# EAGLE design Adafruit proto pi plate (EAGLE 6.2)
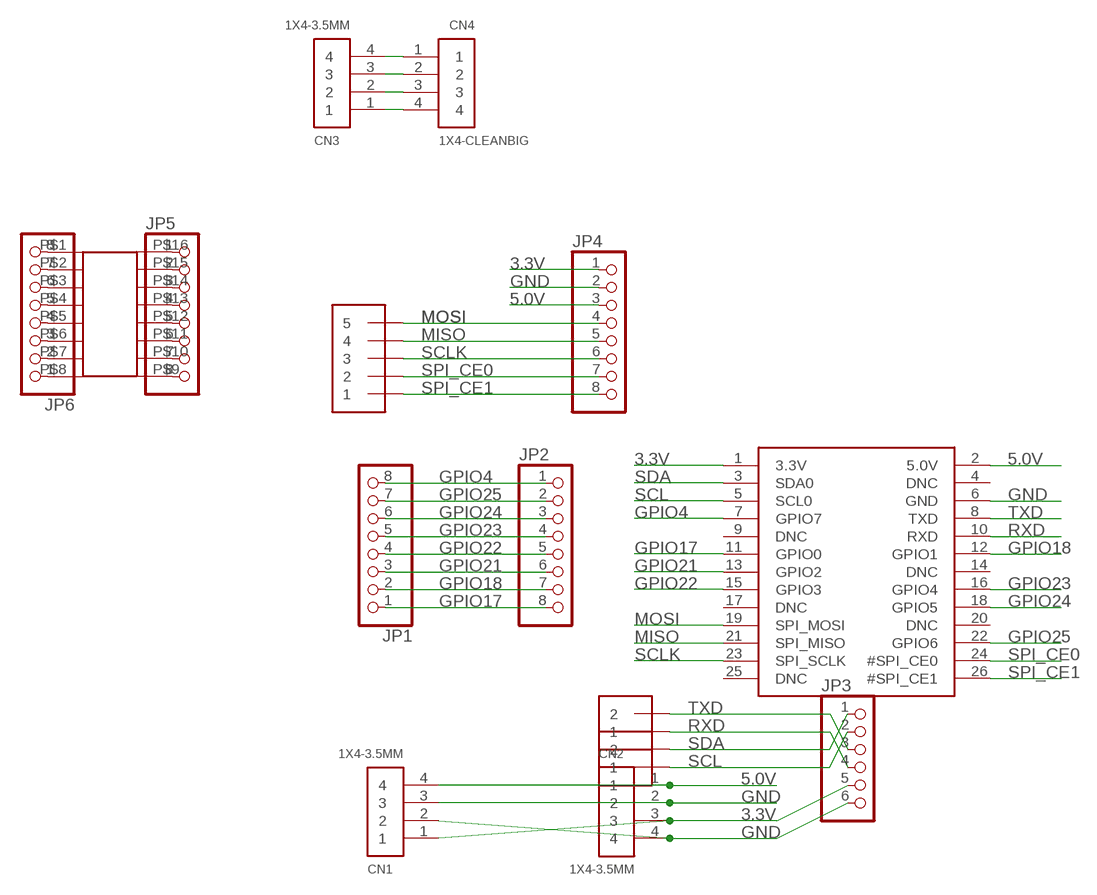
[diagram p0: schematic, sheet 1]

## Parts
CN1  1X4-3.5MM  [1X04-3.5MM]
CN2  1X4-3.5MM  [1X04-3.5MM]
CN3  1X4-3.5MM  [1X04-3.5MM]
CN4  1X4-CLEANBIG  [1X04-CLEANBIG]
J1  1X2-3.5MM  [1X2-3.5MM]
J2  1X2-3.5MM  [1X2-3.5MM]
J3  1X5  [1X05-3.5MM]
JP1  PINHD-1X8-3.5MM  [1X08-3.5MM]
JP2  PINHD-1X8BIG  [1X08-BIG]
JP3  PINHD-1X6B  [1X06-BIG]
JP4  PINHD-1X8BIG  [1X08-BIG]
JP5  PINHD-1X8BIG  [1X08-BIG]
JP6  PINHD-1X8BIG  [1X08-BIG]
U$1  RASPBERRYPI_BB  [RASBERRYPI_SHIELD]
U$2  SMD-16SOIC  [SO-16NMW]

## Nets
3.3V: CN1.1 CN2.3 JP3.5 JP4.1 U$1.1(3.3V)
5.0V: CN1.4 CN2.1 JP4.3 U$1.2(5.0V)
GND: CN1.2 CN1.3 CN2.2 CN2.4 JP3.6 JP4.2 U$1.6(GND)
GPIO4: JP1.8 JP2.1 U$1.7(GPIO7)
GPIO17: JP1.1 JP2.8 U$1.11(GPIO0)
GPIO18: JP1.2 JP2.7 U$1.12(GPIO1)
GPIO21: JP1.3 JP2.6 U$1.13(GPIO2)
GPIO22: JP1.4 JP2.5 U$1.15(GPIO3)
GPIO23: JP1.5 JP2.4 U$1.16(GPIO4)
GPIO24: JP1.6 JP2.3 U$1.18(GPIO5)
GPIO25: JP1.7 JP2.2 U$1.22(GPIO6)
MISO: J3.4 JP4.5 U$1.21(SPI_MISO)
MOSI: J3.5 JP4.4 U$1.19(SPI_MOSI)
N$33: JP5.1 U$2.P$16
N$62: JP5.2 U$2.P$15
N$63: JP5.3 U$2.P$14
N$64: JP5.4 U$2.P$13
N$65: JP5.5 U$2.P$12
N$66: JP5.6 U$2.P$11
N$67: JP5.7 U$2.P$10
N$68: JP5.8 U$2.P$9
N$69: JP6.1 U$2.P$8
N$70: JP6.2 U$2.P$7
N$71: JP6.3 U$2.P$6
N$72: JP6.4 U$2.P$5
N$73: JP6.5 U$2.P$4
N$74: JP6.6 U$2.P$3
N$75: JP6.7 U$2.P$2
N$82: JP6.8 U$2.P$1
N$104: CN3.4 CN4.1
N$105: CN3.3 CN4.2
N$106: CN3.2 CN4.3
N$107: CN3.1 CN4.4
RXD: J2.1 JP3.4 U$1.10(RXD)
SCL: J1.1 JP3.2 U$1.5(SCL0)
SCLK: J3.3 JP4.6 U$1.23(SPI_SCLK)
SDA: J1.2 JP3.1 U$1.3(SDA0)
SPI_CE0: J3.2 JP4.7 U$1.24(#SPI_CE0)
SPI_CE1: J3.1 JP4.8 U$1.26(#SPI_CE1)
TXD: J2.2 JP3.3 U$1.8(TXD)
Unconnected: U$1.4(DNC) U$1.9(DNC) U$1.14(DNC) U$1.17(DNC) U$1.20(DNC) U$1.25(DNC)

## Library data of the parts
CN1-CN4 = adafruit:1X4: 4-pin connector
J1 J2 = adafruit:1X2: 3.5mm Terminal block http://www.ladyada.net/library/pcb/eaglelibrary.html
J3 = adafruit:1X5
JP1 JP2 JP4-JP6 = adafruit:PINHD-1X8: PIN HEADER
JP3 = adafruit:PINHD-1X6: PIN HEADER
U$1 = microbuilder:RASPBERRYPI_B
U$2 = boogie:SMD-16

## Board
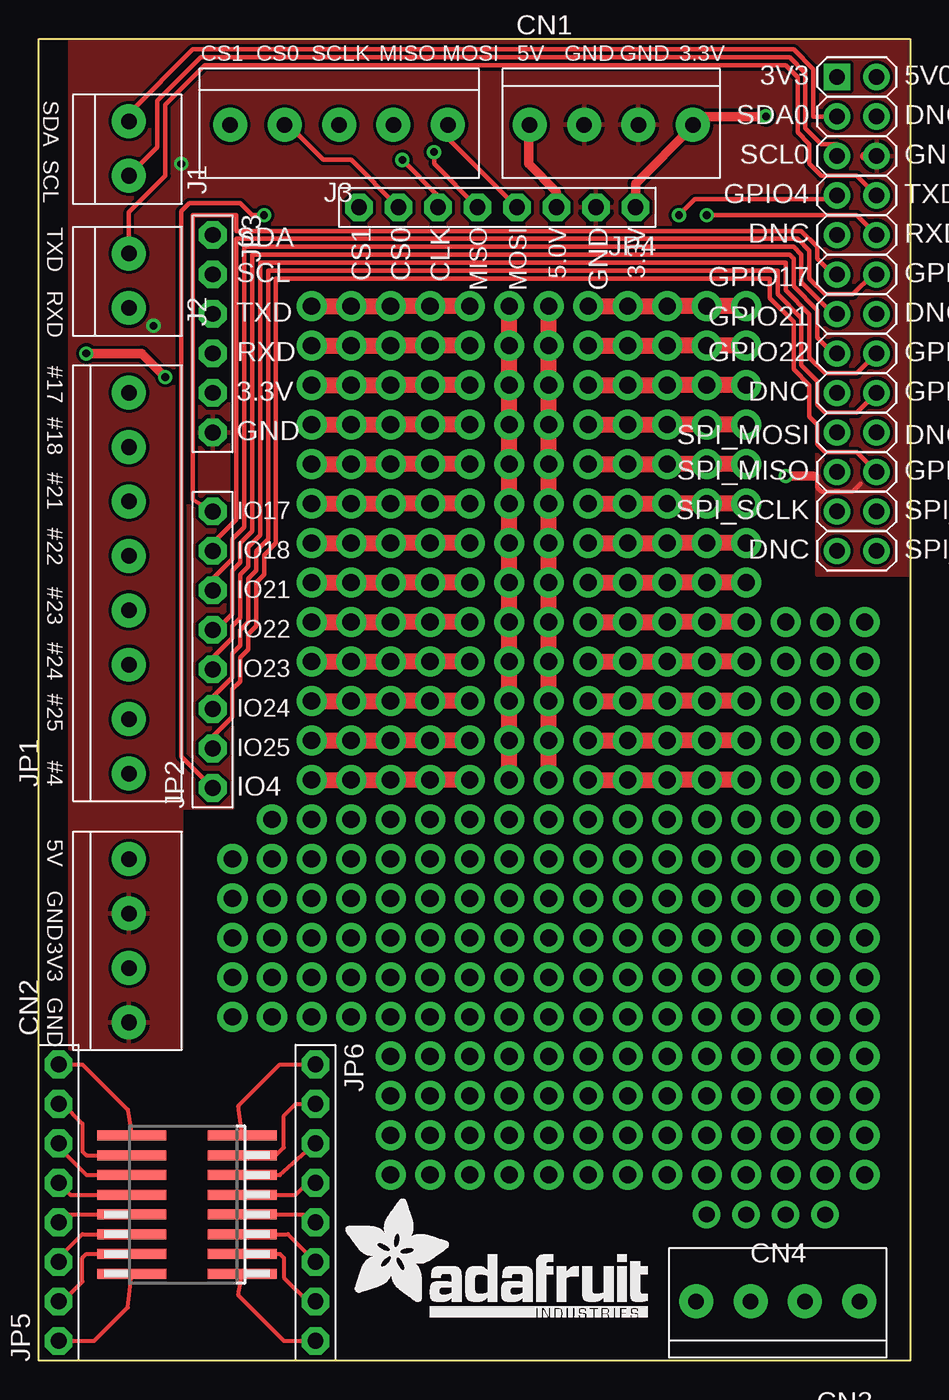
[diagram p1: board, top side]
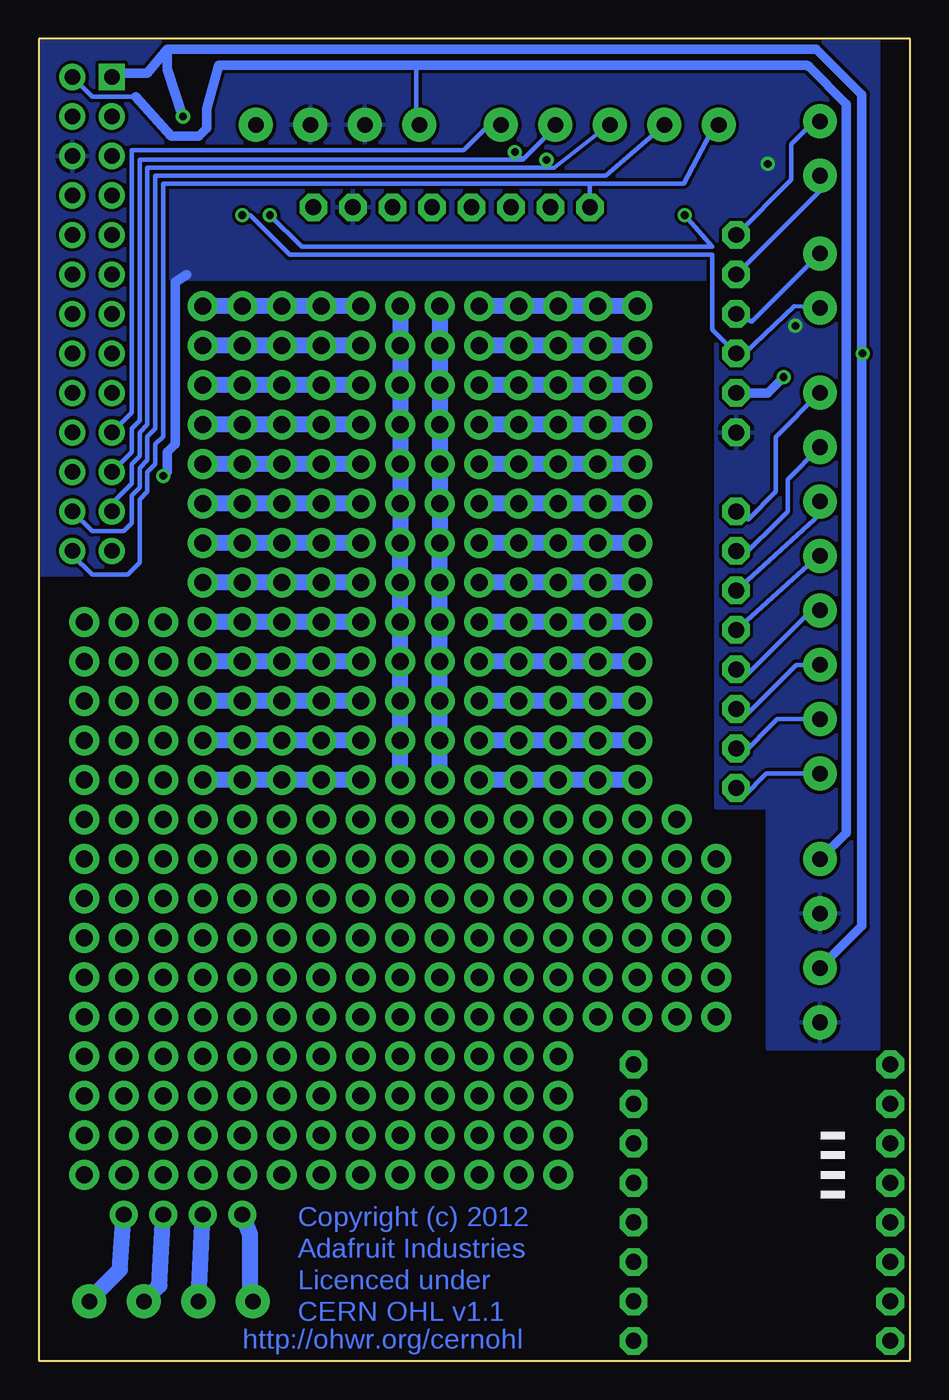
[diagram p2: board, bottom side, seen from below]

Size 56 x 85 mm. Coordinates in mm from the lower left corner, seen from the top.
Outline: 56,0 0,0 0,85 56,85
Copper layers (1*16): Top 0.035mm / dielectric 1.5mm / Bottom 0.035mm
Design rules: minimum track width 8mil, minimum drill 15mil, track to track 8mil, track to pad 8mil, pad to pad 8mil, via to via 8mil, smd to smd 8mil, copper to edge 1mil, drill to drill 8mil, minimum pad ring 10mil, minimum via ring 8mil, stop-mask expansion 4mil, vias tented up to drill 20mil, thermal gap 10mil

### Footprints (pad centres in the part's own frame; a part is rotated, then mirrored left to right if it is on the bottom)
1X04-3.5MM = drill 1 pad 2.184: 1 -5.25,0; 2 -1.75,0; 3 1.75,0; 4 5.25,0
1X04-CLEANBIG = drill 1.016 pad 1.778: 1 -3.81,0; 2 -1.27,0; 3 1.27,0; 4 3.81,0
1X2-3.5MM = drill 1 pad 2.184: 1 1.8,0; 2 -1.7,0
1X05-3.5MM = drill 1 pad 2.184: 1 7,0; 2 3.5,0; 3 0,0; 4 -3.5,0; 5 -7,0
1X08-3.5MM = drill 1 pad 2.184: 1 -12.25,0; 2 -8.75,0; 3 -5.25,0; 4 -1.75,0; 5 1.75,0; 6 5.25,0; 7 8.75,0; 8 12.25,0
1X08-BIG = drill 1.016 pad 1.778 octagon: 1 -8.89,0; 2 -6.35,0; 3 -3.81,0; 4 -1.27,0; 5 1.27,0; 6 3.81,0; 7 6.35,0; 8 8.89,0
1X06-BIG = drill 1.016 pad 1.778 octagon: 1 -6.35,0; 2 -3.81,0; 3 -1.27,0; 4 1.27,0; 5 3.81,0; 6 6.35,0
RASBERRYPI_SHIELD = drill 1 pad 1.676 square: 1 51.308,82.55 | drill 1 pad 1.676: 2 53.848,82.55; 3 51.308,80.01; 4 53.848,80.01; 5 51.308,77.47; 6 53.848,77.47; 7 51.308,74.93; 8 53.848,74.93; 9 51.308,72.39; 10 53.848,72.39; 11 51.308,69.85; 12 53.848,69.85; 13 51.308,67.31; 14 53.848,67.31; 15 51.308,64.77; 16 53.848,64.77; 17 51.308,62.23; 18 53.848,62.23; 19 51.308,59.69; 20 53.848,59.69; 21 51.308,57.15; 22 53.848,57.15; 23 51.308,54.61; 24 53.848,54.61; 25 51.308,52.07; 26 53.848,52.07
SO-16NMW = smd 0.635 x 4.445: P$1 -3.048,-3.683; P$2 -1.778,-3.683; P$3 -0.508,-3.683; P$4 0.762,-3.683; P$5 2.032,-3.683; P$6 3.302,-3.683; P$7 4.572,-3.683; P$8 5.842,-3.683; P$9 5.842,3.429; P$10 4.572,3.429; P$11 3.302,3.429; P$12 2.032,3.429; P$13 0.762,3.429; P$14 -0.508,3.429; P$15 -1.778,3.429; P$16 -3.048,3.429

### Placement (x,y rotation side)
CN1  36.79,79.47 180 top
CN2  5.79,27 270 top
CN3  47.5,3.81 0 top
CN4  46.74,9.4 180 top
J1  5.79,78 270 top
J2  5.79,69.5 270 top
J3  19.29,79.47 180 top
JP1  5.79,50 270 top
JP2  11.18,45.72 90 top
JP3  11.18,66.04 270 top
JP4  29.46,74.17 180 top
JP5  1.27,10.16 90 top
JP6  17.78,10.16 270 top
U$1  0,0 0 top
U$2  9.4,8.64 90 top
U$3  [ADAFRUIT_TEXT_20MM]  19.56,2.79 0 top

### Tracks (layer width: path | path; a pad name or v marks a point on that pad's centre or on a via)
3.3V  (via drill 0.5)
  Top 0.61: JP4.1 38.35,75.69 42.04,79.38 CN1.1 42.59,80.01 v46.74,80.01 | v3.05,64.77 6.6,64.77 v8.13,63.25
  Bottom 0.61: CN2.3 3.09,27.95 3.09,64.77 | 3.09,64.77 3.09,81.4 6.01,84.33 47.75,84.33 | U$1.1 51.05,82.8 49.02,82.8 47.75,84.33 | v46.74,80.01 47.75,83.06 47.75,84.33 | 3.09,64.77 v3.05,64.77 | JP3.5 9.14,62.23 v8.13,63.25
5.0V
  Top 0.61: JP4.3 33.27,75.18 31.5,76.96 31.5,79.42 CN1.4
  Bottom 0.305: CN1.4 31.58,79.5 31.75,79.5 31.75,83.31 | U$1.2 52.58,81.28 49.78,81.28
  Bottom 0.61: CN2.1 4.09,33.95 4.09,80.8 6.49,83.2 6.63,83.31 31.75,83.31 44.45,83.31 45.21,80.52 45.21,79.25 45.72,78.74 47.5,78.74 49.78,81.28 | CN1.4 31.49,79.47
GND  (via drill 0.5)
  Top 0.305: 52.83,56.39 52.32,55.88 50.29,55.88 50.04,56.13 50.04,56.9 49.78,56.9
  Top 0.61: U$1.6 53.09,77.47 | v48.01,56.9 49.78,56.9
  Bottom 0.61: v48.01,56.9 47.75,57.15 47.75,58.42 47.24,58.93 47.24,69.34 46.48,69.85
  other vias: 7.37,66.55 9.14,76.96
  pour Bottom: 2.03,20.07 2.03,85.09 55.88,85.09 56.13,50.55 50.04,50.55 50.04,69.6 12.45,69.6 12.45,35.56 9.14,35.56 9.14,20.07
  pour Top: 2.03,20.07 2.03,85.09 55.88,85.09 56.13,50.55 50.04,50.55 50.04,69.6 12.45,69.6 12.45,35.56 9.14,35.56 9.14,20.07
GPIO4  (via drill 0.5)
  Top 0.305: JP2.1 9.14,38.86 9.14,73.91 9.65,74.42 12.95,74.42 13.72,73.66 v14.48,73.66 | v41.15,73.66 42.16,74.68 51.05,74.68 U$1.7
  Bottom 0.305: JP2.1 10.67,36.32 9.24,37.75 JP1.8 | v14.48,73.66 12.7,71.63 39.12,71.63 v41.15,73.66
GPIO17
  Top 0.305: JP2.8 9.91,55.37 9.91,73.66 12.7,73.66 12.7,72.64 49.02,72.64 50.04,71.63 50.04,70.87 51.05,69.85 U$1.11
  Bottom 0.305: JP1.1 8.64,59.4 8.64,55.88 10.41,54.1 JP2.8
GPIO18
  Top 0.305: U$1.12 53.59,69.85 52.32,68.58 50.55,68.58 49.53,69.6 49.53,71.37 48.77,72.14 12.7,72.14 12.7,54.1 11.18,52.58 JP2.7
  Bottom 0.305: JP1.2 7.87,56.66 7.87,54.61 11.18,51.31 JP2.7
GPIO21
  Top 0.305: U$1.13 51.05,67.31 49.02,69.34 49.02,71.12 48.51,71.63 13.21,71.63 13.21,53.59 12.45,52.83 12.45,51.56 11.18,50.29 JP2.6
  Bottom 0.305: JP1.3 5.79,54.41 JP2.6
GPIO22
  Top 0.305: U$1.15 51.05,64.77 50.04,65.79 50.04,67.56 48.51,69.09 48.51,70.87 48.26,71.12 13.72,71.12 13.72,53.34 12.95,52.58 12.95,51.31 12.45,50.8 12.45,48.01 11.43,46.99 JP2.5
  Bottom 0.305: JP1.4 5.91,51.75 JP2.5
GPIO23
  Top 0.305: U$1.16 52.58,63.5 50.55,63.5 49.53,64.52 49.53,67.31 48.01,68.83 48.01,70.61 14.22,70.61 14.22,53.09 13.46,52.32 13.46,51.05 12.95,50.55 12.95,47.75 12.45,47.24 12.45,46.48 11.18,45.21 JP2.4
  Bottom 0.305: JP2.4 10.67,43.94 6.36,48.25 JP1.5
GPIO24
  Top 0.305: 11.43,41.4 JP2.3 11.18,42.67 12.45,43.94 12.45,45.47 12.95,45.97 12.95,46.99 13.46,47.5 13.46,50.29 13.97,50.8 13.97,52.07 14.73,52.83 14.73,70.1 47.5,70.1 47.5,68.58 49.02,67.06 49.02,64.01 50.04,62.99 50.04,61.47 50.55,60.96 52.58,60.96 U$1.18
  Bottom 0.305: JP2.3 10.67,41.4 7.32,44.75 JP1.6
GPIO25
  Top 0.305: U$1.22 52.58,58.42 50.55,58.42 50.04,58.93 50.04,60.2 49.53,60.71 49.53,62.74 48.51,63.75 48.51,66.8 46.99,68.33 46.99,69.6 15.24,69.6 15.24,52.58 14.48,51.82 14.48,50.55 13.97,50.04 13.97,47.24 13.46,46.74 13.46,45.72 12.95,45.21 12.95,43.69 12.45,43.18 12.45,41.4 11.18,40.13 JP2.2
  Bottom 0.305: JP2.2 10.92,38.86 8.53,41.25 JP1.7
MISO  (via drill 0.5)
  Top 0.305: JP4.5 25.4,76.96 v25.4,77.72
  Bottom 0.305: U$1.21 50.04,58.42 50.04,59.94 49.53,60.45 49.53,77.22 24.89,77.22 | J3.4 22.79,79.31 24.89,77.22 | 24.89,77.22 v25.4,77.72
MOSI
  Top 0.305: J3.5 26.33,79.5 26.42,79.5 26.42,78.49 JP4.4
  Bottom 0.305: 51.24,59.76 51.24,59.8 51.31,59.87 | 51.31,59.87 51.31,59.94 | 51.31,59.87 U$1.19 50.04,60.96 50.04,77.83 28.7,77.83 27.03,79.5 26.42,79.5 | 26.42,79.5 26.38,79.47 J3.5 26.33,79.5 26.42,79.5
N$1  (via drill 1.1 pad 1.93)
  other vias: 17.53,34.8
N$2  (via drill 1.1 pad 1.93)
  other vias: 20.07,34.8
N$3  (via drill 1.1 pad 1.93)
  other vias: 22.61,34.8
N$4  (via drill 1.1 pad 1.93)
  other vias: 25.15,34.8
N$5  (via drill 1.1 pad 1.93)
  other vias: 27.69,34.8
N$6  (via drill 1.1 pad 1.93)
  Top 1.016: v30.23,37.34 v30.23,67.82
  Bottom 1.016: v30.23,67.82 v30.23,65.28 v30.23,62.74 v30.23,60.2 v30.23,57.66 v30.23,55.12 v30.23,52.58 v30.23,50.04 v30.23,47.5 v30.23,44.96 v30.23,42.42 v30.23,39.88 v30.23,37.34
N$7  (via drill 1.1 pad 1.93)
  other vias: 30.23,34.8
N$8  (via drill 1.1 pad 1.93)
  Top 1.016: v32.77,37.34 v32.77,67.82
  Bottom 1.016: v32.77,67.82 v32.77,65.28 v32.77,62.74 v32.77,60.2 v32.77,57.66 v32.77,55.12 v32.77,52.58 v32.77,50.04 v32.77,47.5 v32.77,44.96 v32.77,42.42 v32.77,39.88 v32.77,37.34
N$9  (via drill 1.1 pad 1.93)
  other vias: 32.77,34.8
N$10  (via drill 1.1 pad 1.93)
  other vias: 35.31,34.8
N$11  (via drill 1.1 pad 1.93)
  other vias: 37.85,34.8
N$12  (via drill 1.1 pad 1.93)
  other vias: 40.39,34.8
N$13  (via drill 1.1 pad 1.93)
  other vias: 17.53,32.26
N$14  (via drill 1.1 pad 1.93)
  other vias: 17.53,29.72
N$15  (via drill 1.1 pad 1.93)
  other vias: 17.53,27.18
N$16  (via drill 1.1 pad 1.93)
  other vias: 17.53,24.64
N$17  (via drill 1.1 pad 1.93)
  other vias: 20.07,24.64
N$18  (via drill 1.1 pad 1.93)
  other vias: 20.07,27.18
N$19  (via drill 1.1 pad 1.93)
  other vias: 20.07,29.72
N$20  (via drill 1.1 pad 1.93)
  other vias: 20.07,32.26
N$21  (via drill 1.1 pad 1.93)
  other vias: 22.61,32.26
N$22  (via drill 1.1 pad 1.93)
  other vias: 22.61,29.72
N$23  (via drill 1.1 pad 1.93)
  other vias: 22.61,27.18
N$24  (via drill 1.1 pad 1.93)
  other vias: 22.61,24.64
N$25  (via drill 1.1 pad 1.93)
  other vias: 25.15,24.64
N$26  (via drill 1.1 pad 1.93)
  other vias: 25.15,27.18
N$27  (via drill 1.1 pad 1.93)
  other vias: 25.15,29.72
N$28  (via drill 1.1 pad 1.93)
  other vias: 25.15,32.26
N$29  (via drill 1.1 pad 1.93)
  other vias: 27.69,32.26
N$30  (via drill 1.1 pad 1.93)
  other vias: 27.69,29.72
N$31  (via drill 1.1 pad 1.93)
  other vias: 27.69,27.18
N$32  (via drill 1.1 pad 1.93)
  other vias: 27.69,24.64
N$33
  Top 0.254: U$2.P$16 5.71,3.43 3.56,1.27 JP5.1
N$34  (via drill 1.1 pad 1.93)
  other vias: 42.93,34.8
N$35  (via drill 1.1 pad 1.93)
  other vias: 42.93,29.72
N$36  (via drill 1.1 pad 1.93)
  other vias: 42.93,32.26
N$37  (via drill 1.1 pad 1.93)
  other vias: 42.93,27.18
N$38  (via drill 1.1 pad 1.93)
  other vias: 42.93,24.64
N$39  (via drill 1.1 pad 1.93)
  other vias: 42.93,22.1
N$40  (via drill 1.1 pad 1.93)
  other vias: 42.93,19.56
N$41  (via drill 1.1 pad 1.93)
  other vias: 30.23,24.64
N$42  (via drill 1.1 pad 1.93)
  other vias: 32.77,24.64
N$43  (via drill 1.1 pad 1.93)
  other vias: 35.31,24.64
N$44  (via drill 1.1 pad 1.93)
  other vias: 37.85,24.64
N$45  (via drill 1.1 pad 1.93)
  other vias: 40.39,24.64
N$46  (via drill 1.1 pad 1.93)
  other vias: 40.39,27.18
N$47  (via drill 1.1 pad 1.93)
  other vias: 40.39,29.72
N$48  (via drill 1.1 pad 1.93)
  other vias: 40.39,32.26
N$49  (via drill 1.1 pad 1.93)
  other vias: 37.85,32.26
N$50  (via drill 1.1 pad 1.93)
  other vias: 35.31,32.26
N$51  (via drill 1.1 pad 1.93)
  other vias: 30.23,32.26
N$52  (via drill 1.1 pad 1.93)
  other vias: 30.23,29.72
N$53  (via drill 1.1 pad 1.93)
  other vias: 30.23,27.18
N$54  (via drill 1.1 pad 1.93)
  other vias: 32.77,27.18
N$55  (via drill 1.1 pad 1.93)
  other vias: 32.77,29.72
N$56  (via drill 1.1 pad 1.93)
  other vias: 32.77,32.26
N$57  (via drill 1.1 pad 1.93)
  other vias: 35.31,29.72
N$58  (via drill 1.1 pad 1.93)
  other vias: 35.31,27.18
N$59  (via drill 1.1 pad 1.93)
  other vias: 37.85,27.18
N$60  (via drill 1.1 pad 1.93)
  other vias: 37.85,29.72
N$61  (via drill 1.1 pad 1.93)
  other vias: 17.53,22.1
N$62
  Top 0.254: U$2.P$15 3.05,6.86 2.79,6.6 2.79,5.08 1.52,3.81 JP5.2
N$63
  Top 0.254: JP5.3 1.27,6.6 2.79,8.13 U$2.P$14
N$64
  Top 0.254: U$2.P$13 1.78,9.4 JP5.4
N$65
  Top 0.254: U$2.P$12 2.03,10.67 JP5.5
N$66
  Top 0.254: JP5.6 1.27,13.72 3.05,11.94 U$2.P$11
N$67
  Top 0.254: U$2.P$10 3.05,13.21 2.79,13.46 2.79,15.24 1.52,16.51 JP5.7
N$68
  Top 0.254: U$2.P$9 5.71,16.13 2.79,19.05 JP5.8
N$69
  Top 0.254: U$2.P$8 12.83,16.38 15.49,19.05 JP6.1
N$70
  Top 0.254: U$2.P$7 15.24,13.21 15.75,13.72 15.75,15.75 16.51,16.51 JP6.2
N$71
  Top 0.254: U$2.P$6 15.49,11.94 JP6.3
N$72
  Top 0.254: JP6.4 17.27,11.43 16.51,10.67 U$2.P$5
N$73
  Top 0.254: U$2.P$4 17.02,9.4 JP6.5
N$74
  Top 0.254: U$2.P$3 16,8.13 JP6.6
N$75
  Top 0.254: U$2.P$2 15.49,6.86 15.75,6.6 15.75,5.33 17.27,3.81 JP6.7
N$76  (via drill 1.1 pad 1.93)
  other vias: 20.07,22.1
N$77  (via drill 1.1 pad 1.93)
  other vias: 22.61,22.1
N$78  (via drill 1.1 pad 1.93)
  other vias: 22.61,19.56
N$79  (via drill 1.1 pad 1.93)
  other vias: 22.61,14.48
N$80  (via drill 1.1 pad 1.93)
  other vias: 22.61,17.02
N$81  (via drill 1.1 pad 1.93)
  other vias: 22.61,11.94
N$82
  Top 0.254: U$2.P$1 12.83,4.19 15.75,1.27 JP6.8
N$83  (via drill 1.1 pad 1.93)
  other vias: 12.45,32.26
N$84  (via drill 1.1 pad 1.93)
  other vias: 12.45,29.72
N$85  (via drill 1.1 pad 1.93)
  other vias: 12.45,27.18
N$86  (via drill 1.1 pad 1.93)
  other vias: 12.45,24.64
N$87  (via drill 1.1 pad 1.93)
  other vias: 25.15,11.94
N$88  (via drill 1.1 pad 1.93)
  other vias: 25.15,17.02
N$89  (via drill 1.1 pad 1.93)
  other vias: 25.15,19.56
N$90  (via drill 1.1 pad 1.93)
  other vias: 25.15,22.1
N$91  (via drill 1.1 pad 1.93)
  other vias: 27.69,22.1
N$92  (via drill 1.1 pad 1.93)
  other vias: 27.69,17.02
N$93  (via drill 1.1 pad 1.93)
  other vias: 27.69,19.56
N$94  (via drill 1.1 pad 1.93)
  other vias: 27.69,11.94
N$95  (via drill 1.1 pad 1.93)
  other vias: 25.15,14.48
N$96  (via drill 1.1 pad 1.93)
  other vias: 27.69,14.48
N$97  (via drill 1.1 pad 1.93)
  other vias: 12.45,22.1
N$98  (via drill 1.1 pad 1.93)
  other vias: 14.99,34.8
N$101  (via drill 1.1 pad 1.93)
  other vias: 42.93,17.02
N$102  (via drill 1.1 pad 1.93)
  other vias: 42.93,14.48
N$103  (via drill 1.1 pad 1.93)
  other vias: 42.93,11.94
N$104
  Bottom 1.016: CN3.4 53,3.64 50.8,5.84 CN4.1
N$105
  Bottom 1.016: CN3.3 49.5,3.58 48.26,4.83 CN4.2
N$106
  Bottom 1.016: CN3.2 46,3.78 45.72,4.06 CN4.3
N$107
  Bottom 1.016: CN3.1 42.42,3.56 42.42,8.13 CN4.4
N$110  (via drill 1.1 pad 1.93)
  other vias: 45.47,11.94
N$111  (via drill 1.1 pad 1.93)
  other vias: 45.47,14.48
N$112  (via drill 1.1 pad 1.93)
  other vias: 45.47,19.56
N$113  (via drill 1.1 pad 1.93)
  other vias: 45.47,17.02
N$114  (via drill 1.1 pad 1.93)
  other vias: 45.47,22.1
N$115  (via drill 1.1 pad 1.93)
  other vias: 45.47,24.64
N$116  (via drill 1.1 pad 1.93)
  other vias: 45.47,27.18
N$119  (via drill 1.1 pad 1.93)
  other vias: 30.23,11.94
N$120  (via drill 1.1 pad 1.93)
  other vias: 30.23,14.48
N$121  (via drill 1.1 pad 1.93)
  other vias: 30.23,19.56
N$122  (via drill 1.1 pad 1.93)
  other vias: 30.23,22.1
N$123  (via drill 1.1 pad 1.93)
  other vias: 32.77,22.1
N$124  (via drill 1.1 pad 1.93)
  other vias: 35.31,22.1
N$125  (via drill 1.1 pad 1.93)
  other vias: 37.85,22.1
N$126  (via drill 1.1 pad 1.93)
  other vias: 40.39,22.1
N$127  (via drill 1.1 pad 1.93)
  other vias: 40.39,19.56
N$128  (via drill 1.1 pad 1.93)
  other vias: 37.85,19.56
N$129  (via drill 1.1 pad 1.93)
  other vias: 35.31,19.56
N$130  (via drill 1.1 pad 1.93)
  other vias: 32.77,19.56
N$131  (via drill 1.1 pad 1.93)
  other vias: 32.77,17.02
N$132  (via drill 1.1 pad 1.93)
  other vias: 30.23,17.02
N$133  (via drill 1.1 pad 1.93)
  other vias: 35.31,17.02
N$134  (via drill 1.1 pad 1.93)
  other vias: 37.85,17.02
N$135  (via drill 1.1 pad 1.93)
  other vias: 40.39,17.02
N$136  (via drill 1.1 pad 1.93)
  other vias: 40.39,14.48
N$137  (via drill 1.1 pad 1.93)
  other vias: 37.85,14.48
N$138  (via drill 1.1 pad 1.93)
  other vias: 35.31,14.48
N$139  (via drill 1.1 pad 1.93)
  other vias: 32.77,14.48
N$140  (via drill 1.1 pad 1.93)
  other vias: 32.77,11.94
N$142  (via drill 1.1 pad 1.93)
  other vias: 45.47,29.72
N$153  (via drill 1.1 pad 1.93)
  other vias: 35.31,11.94
N$154  (via drill 1.1 pad 1.93)
  other vias: 37.85,11.94
N$155  (via drill 1.1 pad 1.93)
  other vias: 40.39,11.94
N$157  (via drill 1.1 pad 1.93)
  other vias: 45.47,32.26
N$158  (via drill 1.1 pad 1.93)
  other vias: 45.47,34.8
N$159  (via drill 1.1 pad 1.93)
  other vias: 48.01,34.8
N$160  (via drill 1.1 pad 1.93)
  other vias: 48.01,32.26
N$161  (via drill 1.1 pad 1.93)
  other vias: 48.01,29.72
N$162  (via drill 1.1 pad 1.93)
  other vias: 48.01,27.18
N$163  (via drill 1.1 pad 1.93)
  other vias: 48.01,24.64
N$164  (via drill 1.1 pad 1.93)
  other vias: 48.01,22.1
N$165  (via drill 1.1 pad 1.93)
  other vias: 48.01,19.56
N$166  (via drill 1.1 pad 1.93)
  other vias: 48.01,17.02
N$167  (via drill 1.1 pad 1.93)
  other vias: 14.99,32.26
N$168  (via drill 1.1 pad 1.93)
  other vias: 14.99,29.72
N$169  (via drill 1.1 pad 1.93)
  other vias: 14.99,27.18
N$170  (via drill 1.1 pad 1.93)
  other vias: 14.99,24.64
N$171  (via drill 1.1 pad 1.93)
  other vias: 14.99,22.1
N$198  (via drill 1.1 pad 1.93)
  Top 1.016: v17.53,67.82 v20.07,67.82 v22.61,67.82 v25.15,67.82 v27.69,67.82
  Bottom 1.016: v17.53,67.82 v27.69,67.82
N$204  (via drill 1.1 pad 1.93)
  other vias: 53.09,11.94
N$205  (via drill 1.1 pad 1.93)
  other vias: 50.55,11.94
N$206  (via drill 1.1 pad 1.93)
  other vias: 48.01,11.94
N$218  (via drill 1.1 pad 1.93)
  other vias: 53.09,14.48
N$219  (via drill 1.1 pad 1.93)
  other vias: 50.55,14.48
N$220  (via drill 1.1 pad 1.93)
  other vias: 48.01,14.48
N$221  (via drill 1.1 pad 1.93)
  other vias: 50.55,17.02
N$222  (via drill 1.1 pad 1.93)
  other vias: 53.09,17.02
N$225  (via drill 1.1 pad 1.93)
  other vias: 53.09,19.56
N$226  (via drill 1.1 pad 1.93)
  other vias: 50.55,19.56
N$227  (via drill 1.1 pad 1.93)
  other vias: 50.55,22.1
N$228  (via drill 1.1 pad 1.93)
  other vias: 53.09,22.1
N$231  (via drill 1.1 pad 1.93)
  other vias: 53.09,24.64
N$232  (via drill 1.1 pad 1.93)
  other vias: 50.55,24.64
N$233  (via drill 1.1 pad 1.93)
  other vias: 50.55,27.18
N$234  (via drill 1.1 pad 1.93)
  other vias: 50.55,47.5
N$235  (via drill 1.1 pad 1.93)
  other vias: 50.55,44.96
N$236  (via drill 1.1 pad 1.93)
  other vias: 50.55,42.42
N$237  (via drill 1.1 pad 1.93)
  other vias: 50.55,39.88
N$238  (via drill 1.1 pad 1.93)
  other vias: 50.55,37.34
N$239  (via drill 1.1 pad 1.93)
  other vias: 50.55,34.8
N$240  (via drill 1.1 pad 1.93)
  other vias: 50.55,32.26
N$241  (via drill 1.1 pad 1.93)
  other vias: 50.55,29.72
N$242  (via drill 1.1 pad 1.93)
  other vias: 53.09,29.72
N$243  (via drill 1.1 pad 1.93)
  other vias: 53.09,27.18
N$253  (via drill 1.1 pad 1.93)
  other vias: 53.09,47.5
N$254  (via drill 1.1 pad 1.93)
  other vias: 53.09,42.42
N$255  (via drill 1.1 pad 1.93)
  other vias: 53.09,44.96
N$256  (via drill 1.1 pad 1.93)
  other vias: 53.09,39.88
N$257  (via drill 1.1 pad 1.93)
  other vias: 53.09,37.34
N$258  (via drill 1.1 pad 1.93)
  other vias: 53.09,34.8
N$259  (via drill 1.1 pad 1.93)
  other vias: 53.09,32.26
N$260  (via drill 1.1 pad 1.93)
  Top 1.016: v17.53,65.28 v20.07,65.28 v22.61,65.28 v25.15,65.28 v27.69,65.28
  Bottom 1.016: v17.53,65.28 v27.69,65.28
N$261  (via drill 1.1 pad 1.93)
  Top 1.016: v17.53,62.74 v20.07,62.74 v22.61,62.74 v25.15,62.74 v27.69,62.74
  Bottom 1.016: v17.53,62.74 v27.69,62.74
N$262  (via drill 1.1 pad 1.93)
  Top 1.016: v17.53,60.2 v20.07,60.2 v22.61,60.2 v25.15,60.2 v27.69,60.2
  Bottom 1.016: v17.53,60.2 v27.69,60.2
N$263  (via drill 1.1 pad 1.93)
  Top 1.016: v17.53,57.66 v20.07,57.66 v22.61,57.66 v25.15,57.66 v27.69,57.66
  Bottom 1.016: v17.53,57.66 v27.69,57.66
N$264  (via drill 1.1 pad 1.93)
  Top 1.016: v17.53,55.12 v20.07,55.12 v22.61,55.12 v25.15,55.12 v27.69,55.12
  Bottom 1.016: v17.53,55.12 v27.69,55.12
N$265  (via drill 1.1 pad 1.93)
  Top 1.016: v17.53,52.58 v20.07,52.58 v22.61,52.58 v25.15,52.58 v27.69,52.58
  Bottom 1.016: v17.53,52.58 v27.69,52.58
N$266  (via drill 1.1 pad 1.93)
  Top 1.016: v17.53,50.04 v20.07,50.04 v22.61,50.04 v25.15,50.04 v27.69,50.04
  Bottom 1.016: v17.53,50.04 v27.69,50.04
N$267  (via drill 1.1 pad 1.93)
  Top 1.016: v17.53,47.5 v20.07,47.5 v22.61,47.5 v25.15,47.5 v27.69,47.5
  Bottom 1.016: v17.53,47.5 v27.69,47.5
N$268  (via drill 1.1 pad 1.93)
  Top 1.016: v17.53,44.96 v20.07,44.96 v22.61,44.96 v25.15,44.96 v27.69,44.96
  Bottom 1.016: v17.53,44.96 v27.69,44.96
N$269  (via drill 1.1 pad 1.93)
  Top 1.016: v17.53,42.42 v20.07,42.42 v22.61,42.42 v25.15,42.42 v27.69,42.42
  Bottom 1.016: v17.53,42.42 v27.69,42.42
N$270  (via drill 1.1 pad 1.93)
  Top 1.016: v17.53,39.88 v20.07,39.88 v22.61,39.88 v25.15,39.88 v27.69,39.88
  Bottom 1.016: v17.53,39.88 v27.69,39.88
N$271  (via drill 1.1 pad 1.93)
  Top 1.016: v35.31,67.82 v37.85,67.82 v40.39,67.82 v42.93,67.82 v45.47,67.82
  Bottom 1.016: v35.31,67.82 v45.47,67.82
N$272  (via drill 1.1 pad 1.93)
  Top 1.016: v35.31,65.28 v37.85,65.28 v40.39,65.28 v42.93,65.28 v45.47,65.28
  Bottom 1.016: v35.31,65.28 v45.47,65.28
N$273  (via drill 1.1 pad 1.93)
  Top 1.016: v35.31,62.74 v37.85,62.74 v40.39,62.74 v42.93,62.74 v45.47,62.74
  Bottom 1.016: v35.31,62.74 v45.47,62.74
N$274  (via drill 1.1 pad 1.93)
  Top 1.016: v35.31,60.2 v37.85,60.2 v40.39,60.2 v42.93,60.2 v45.47,60.2
  Bottom 1.016: v35.31,60.2 v45.47,60.2
N$275  (via drill 1.1 pad 1.93)
  Top 1.016: v35.31,57.66 v37.85,57.66 v40.39,57.66 v42.93,57.66 v45.47,57.66
  Bottom 1.016: v35.31,57.66 v45.47,57.66
N$276  (via drill 1.1 pad 1.93)
  Top 1.016: v35.31,55.12 v37.85,55.12 v40.39,55.12 v42.93,55.12 v45.47,55.12
  Bottom 1.016: v35.31,55.12 v45.47,55.12
N$277  (via drill 1.1 pad 1.93)
  Top 1.016: v35.31,52.58 v37.85,52.58 v40.39,52.58 v42.93,52.58 v45.47,52.58
  Bottom 1.016: v35.31,52.58 v45.47,52.58
N$278  (via drill 1.1 pad 1.93)
  Top 1.016: v35.31,50.04 v37.85,50.04 v40.39,50.04 v42.93,50.04 v45.47,50.04
  Bottom 1.016: v35.31,50.04 v45.47,50.04
N$279  (via drill 1.1 pad 1.93)
  Top 1.016: v35.31,47.5 v37.85,47.5 v40.39,47.5 v42.93,47.5 v45.47,47.5
  Bottom 1.016: v35.31,47.5 v45.47,47.5
N$280  (via drill 1.1 pad 1.93)
  Top 1.016: v35.31,44.96 v37.85,44.96 v40.39,44.96 v42.93,44.96 v45.47,44.96
  Bottom 1.016: v35.31,44.96 v45.47,44.96
N$281  (via drill 1.1 pad 1.93)
  Top 1.016: v35.31,42.42 v37.85,42.42 v40.39,42.42 v42.93,42.42 v45.47,42.42
  Bottom 1.016: v35.31,42.42 v45.47,42.42
N$282  (via drill 1.1 pad 1.93)
  Top 1.016: v35.31,39.88 v37.85,39.88 v40.39,39.88 v42.93,39.88 v45.47,39.88
  Bottom 1.016: v35.31,39.88 v45.47,39.88
N$283  (via drill 1.1 pad 1.93)
  Top 1.016: v17.53,37.34 v20.07,37.34 v22.61,37.34 v25.15,37.34 v27.69,37.34
  Bottom 1.016: v17.53,37.34 v27.69,37.34
N$284  (via drill 1.1 pad 1.93)
  Top 1.016: v35.31,37.34 v37.85,37.34 v40.39,37.34 v42.93,37.34 v45.47,37.34
  Bottom 1.016: v35.31,37.34 v45.47,37.34
N$285  (via drill 1.1 pad 1.93)
  other vias: 48.01,37.34
N$286  (via drill 1.1 pad 1.93)
  other vias: 48.01,39.88
N$287  (via drill 1.1 pad 1.93)
  other vias: 48.01,42.42
N$288  (via drill 1.1 pad 1.93)
  other vias: 48.01,44.96
N$289  (via drill 1.1 pad 1.93)
  other vias: 48.01,47.5
RXD  (via drill 0.5)
  Top 0.305: v42.93,73.66 52.58,73.66 U$1.10
  Bottom 0.305: J2.1 7.45,67.82 10.67,64.77 JP3.4 12.7,66.29 12.7,71.12 39.88,71.12 42.42,73.66 v42.93,73.66
SCL
  Top 0.305: J1.1 7.62,78.03 7.62,81.03 10.41,83.82 48.26,83.82 49.28,82.8 49.28,79.25 50.29,78.23 51.31,78.23 U$1.5
  Bottom 0.305: J1.1 5.84,76.2 5.84,75.18 JP3.2
SCLK  (via drill 0.5)
  Top 0.305: v23.37,77.22 25.65,74.93 JP4.6
  Bottom 0.305: 23.37,76.71 49.02,76.71 49.02,60.2 49.53,59.69 49.53,58.17 50.04,57.66 50.04,56.39 51.31,55.12 U$1.23 | J3.3 19.29,79.49 19.3,79.5 22.86,76.71 23.37,76.71 | 23.37,76.71 v23.37,77.22
SDA
  Top 0.305: U$1.3 49.78,80.01 49.78,83.06 48.51,84.33 9.91,84.33 5.84,80.26 5.84,79.76 J1.2
  Bottom 0.305: JP3.1 7.62,75.95 7.62,78.23 6.1,79.76 5.84,79.76 J1.2
SPI_CE0
  Top 0.305: JP4.7 20.07,77.22 18.29,77.22 16,79.5 15.76,79.5 | 15.76,79.5 15.75,79.5 | J3.2 15.76,79.5
  Bottom 0.305: U$1.24 52.58,53.34 50.55,53.34 50.04,53.85 50.04,55.63 49.53,56.13 49.53,57.4 49.02,57.91 49.02,59.44 48.51,59.94 48.51,76.2 19.56,76.2 15.79,79.46 J3.2
SPI_CE1
  Bottom 0.305: 20.57,75.69 14.55,75.69 12.51,79.5 12.33,79.5 J3.1 | 20.57,75.69 48.01,75.69 48.01,59.44 48.51,58.93 48.51,57.66 49.02,57.15 49.02,55.88 49.53,55.37 49.53,51.31 50.29,50.55 52.58,50.55 53.85,51.82 U$1.26 | 20.57,75.69 JP4.8
TXD
  Top 0.305: J2.2 5.79,73.86 8.13,76.2 8.13,80.77 10.67,83.31 48.01,83.31 48.77,82.55 48.77,78.99 49.53,78.23 49.53,76.96 50.29,76.2 52.58,76.2 U$1.8
  Bottom 0.305: J2.2 10.18,66.8 JP3.3

### Text on the board
Bottom: Copyright (c) 2012 | Adafruit Industries | Licenced under | CERN OHL v1.1 | http://ohwr.org/cernohl
tPlace: CS1 | CS0 | SCLK | MISO | MOSI | 5V | GND | GND | 3.3V | SDA | SCL | TXD | CS1 | CS0 | CLK | MISO | MOSI | 5.0V | GND | 3.3V | SDA | RXD | SCL | TXD | #17 | RXD | 3.3V | #18 | GND | #21 | #22 | IO17 | IO18 | #23 | IO21 | #24 | IO22 | IO23 | #25 | IO24 | #4 | IO25 | IO4 | 5V | GND | 3V3 | GND